# Altium project SL-A025-CTL-ESP07S_V1.0.PrjPcb
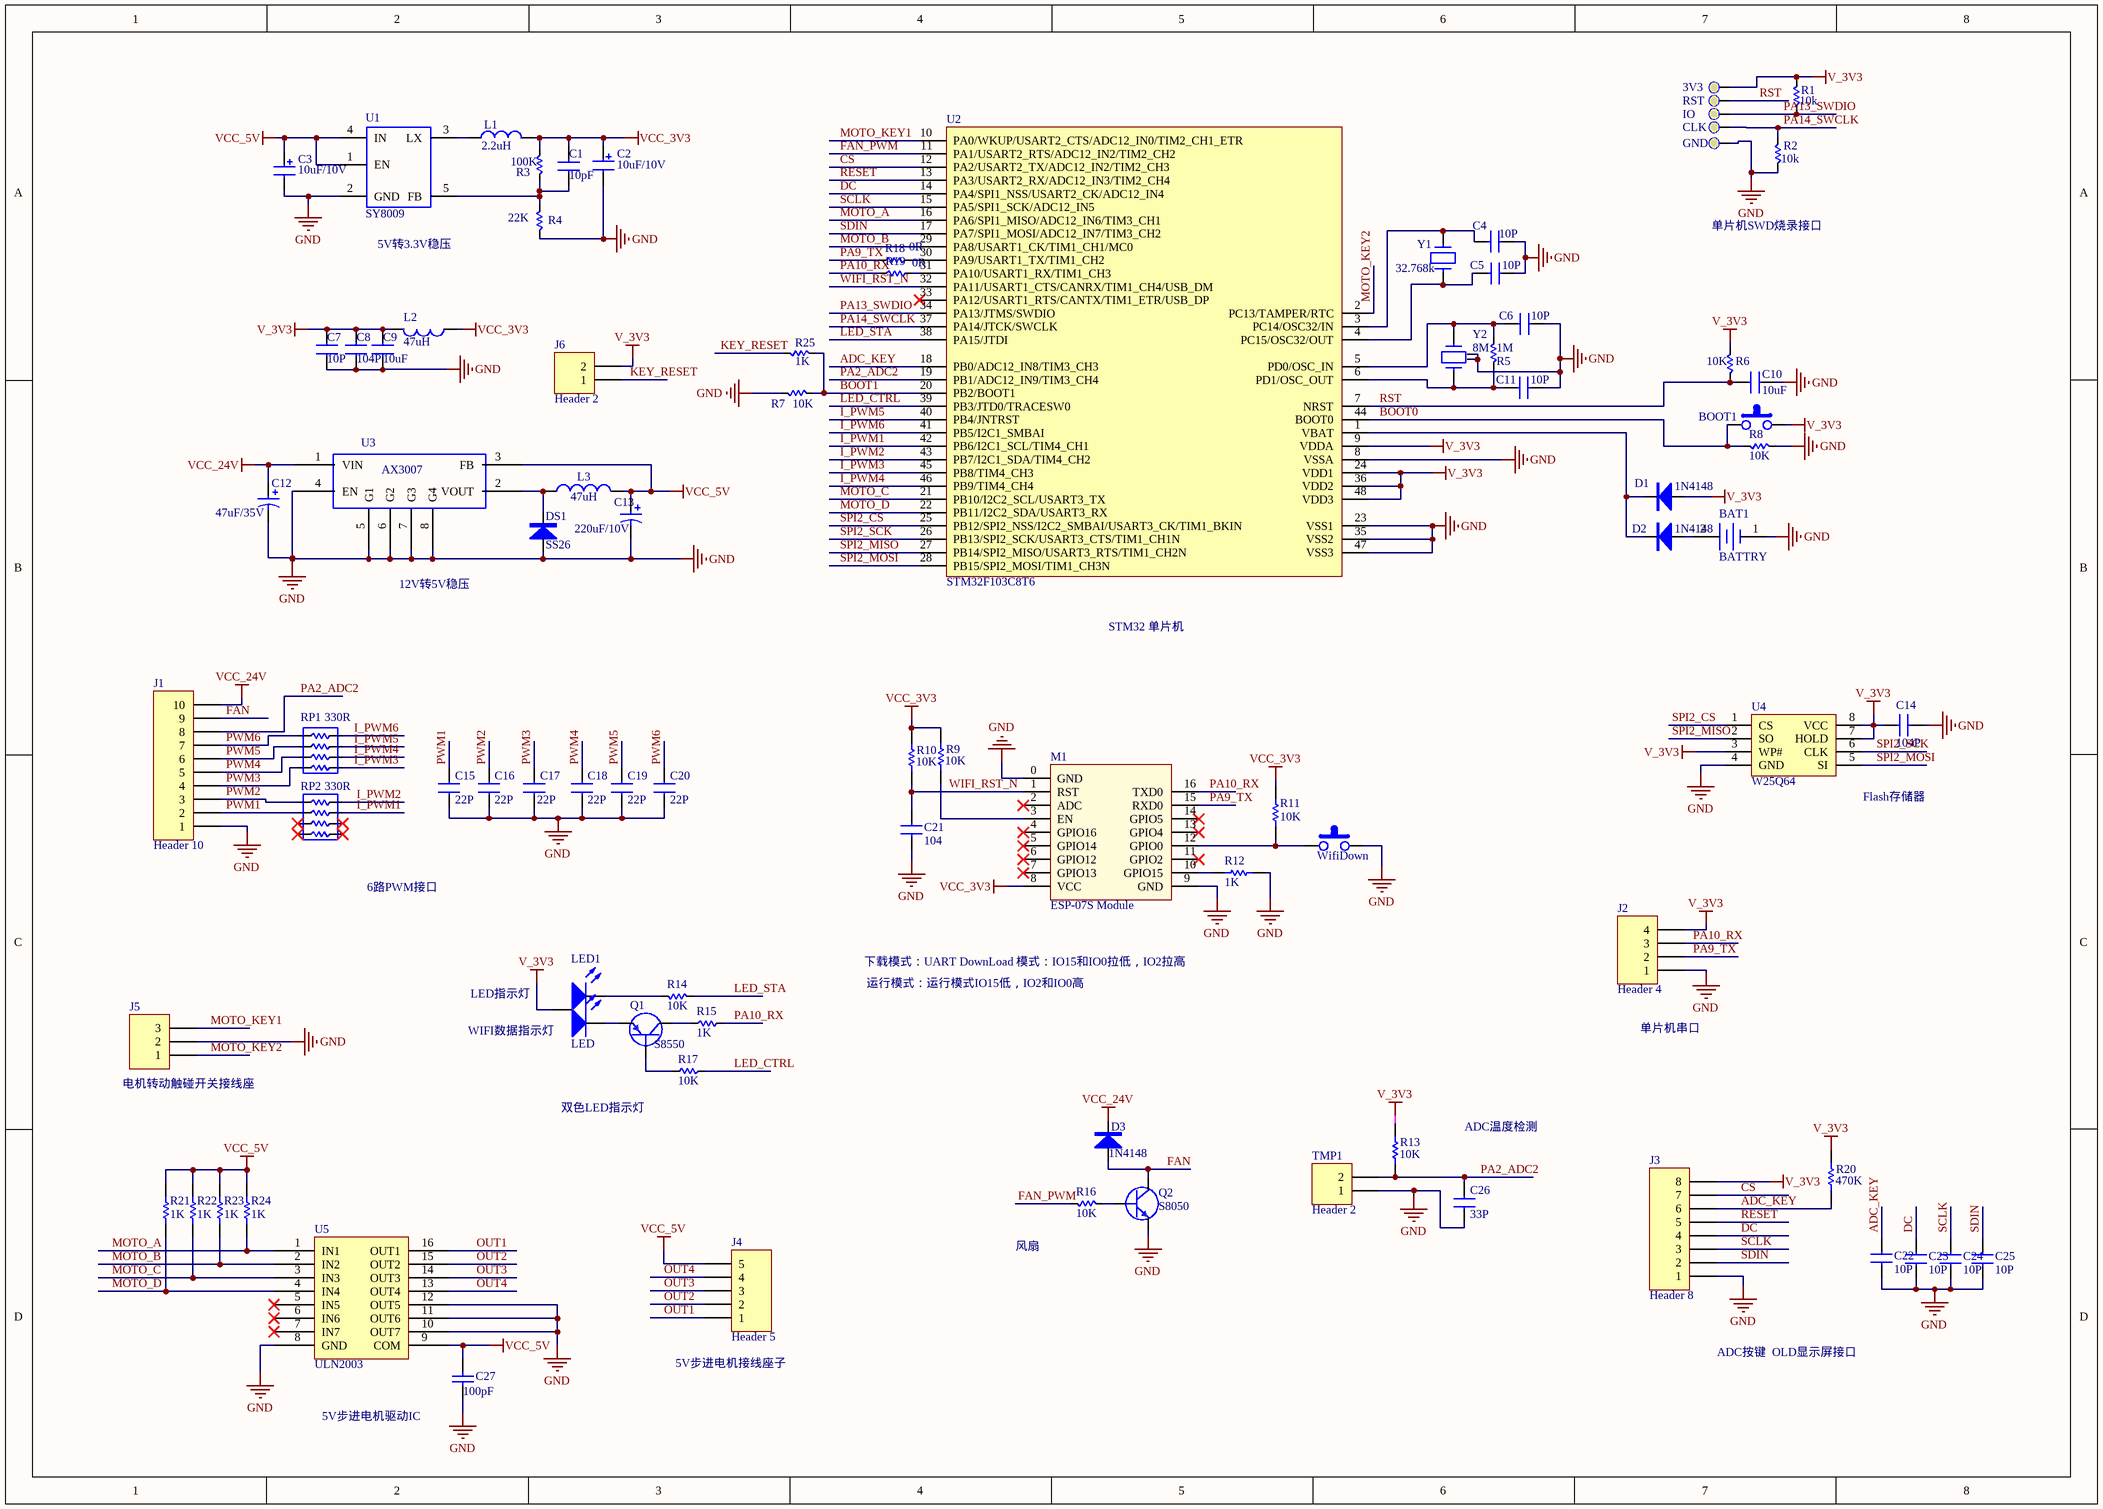
[diagram p0: SL-CA025-ESP07S_V1.0.SchDoc]
1 sheet, 87 parts. Net scope: global (net labels, ports and power ports of the same name join across sheets).
Board file: SL-CA025-ESP07S_V2.2.PcbDoc

## Sheet SL-CA025-ESP07S_V1.0.SchDoc
size A3; Organization: Altium Limited; Address1: L3, 12a Rodborough Rd; Address2: Frenchs Forest; Address3: NSW; Address4: Australia 2086

### Parts
3V3  TP  [TP1]  (value not drawn)
BAT1  BATTRY  [BAT_1220]
BOOT1  SW  [SW_3X6]  (value not drawn)
C1  10pF  [C0603]
C2  10uF/10V  [C0805]
C3  10uF/10V  [C0805]
C4  10P  [C0603]
C5  10P  [C0603]
C6  10P  [C0603]
C7  10P  [C0603]
C8  104P  [C0603]
C9  10uF  [C0805]
C10  10uF  [C0805]
C11  10P  [C0603]
C12  47uF/35V  [C_SMT63(5.9*6.6mm)]
C13  220uF/10V  [C_SMT63(5.9*6.6mm)]
C14  104P  [C0603]
C15  22P  [C0603]
C16  22P  [C0603]
C17  22P  [C0603]
C18  22P  [C0603]
C19  22P  [C0603]
C20  22P  [C0603]
C21  104  [C0603]
C22  10P  [C0603]
C23  10P  [C0603]
C24  10P  [C0603]
C25  10P  [C0603]
C26  33P  [C0603]
C27  value 100pF  [C0603]  (hidden comment: Cap)
CLK  TP  [TP1]  (value not drawn)
D1  1N4148  [D0805]
D2  1N4148  [D0805]
D3  1N4148  [D0805]
DS1  SS26  [SMA]
GND  TP  [TP1]  (value not drawn)
IO  TP  [TP1]  (value not drawn)
J1  Header 10  [CON10_1.5mm]
J2  Header 4  [SIP4A]
J3  Header 8  [con8_1.5mm]
J4  Header 5  [con5_1.5mm]
J5  Header 3  [CON3_1.5mm]  (value not drawn)
J6  Header 2  [CON2_1.5mm]
L1  2.2uH  [L2520]
L2  47uH  [L0805]
L3  47uH  [L_SMRH_7.3x7.3]
LED1  LED  [LED_2K]
M1  ESP-07S Module  [ESP-07S Module]
Q1  S8550  [SOT23-3]
Q2  S8050  [SOT23-3]
R1  10k  [R0603]
R2  10k  [R0603]
R3  100K  [R0603]
R4  22K  [R0603]
R5  1M  [R0603]
R6  10K  [R0603]
R7  10K  [R0603]
R8  10K  [R0603]
R9  10K  [R0603]
R10  10K  [R0603]
R11  10K  [R0603]
R12  1K  [R0603]
R13  10K  [R0603]
R14  10K  [R0603]
R15  1K  [R0603]
R16  10K  [R0603]
R17  10K  [R0603]
R18  0R  [R0603]
R19  0R  [R0603]
R20  470K  [R0603]
R21  value 1K  [R0603]  (hidden comment: Res1)
R22  value 1K  [R0603]  (hidden comment: Res1)
R23  value 1K  [R0603]  (hidden comment: Res1)
R24  value 1K  [R0603]  (hidden comment: Res1)
R25  1K  [R0603]
RP1  330R  [RP4_0603]
RP2  330R  [RP4_0603]
RST  TP  [TP1]  (value not drawn)
TMP1  Header 2  [CON2_1.5mm]
U1  SY8009  [SOT23-5]
U2  STM32F103C8T6  [LQFP48_9.2x9.2mm]
U3  AX3007  [SOP8_N]
U4  W25Q64  [SOIC8]
U5  ULN2003  [SOP16]
WifiDown  SW  [SW_3X6]  (value not drawn)
Y1  32.768k  [XALT_3215]
Y2  8M  [XALT_5032_4P]

### Nets
GND: BAT1.1 C2.2 C3.2 C4.2 C5.2 C6.2 C7.2 C8.2 C9.2 C10.2 C11.2 C12.2 C13.2 C14.2 C15.1 C16.1 C17.1 C18.1 C19.1 C20.1 C21.2 C22.1 C23.1 C24.1 C25.1 C26.1 C27.1 DS1.1(A) GND.1 J1.1 J2.1 J3.1 J5.2 M1.0(GND) M1.9(GND) Q2.2(E) R2.1 R4.1 R7.2 R8.2 R12.2 TMP1.1 U1.2(GND) U2.8(VSSA) U2.23(VSS1) U2.35(VSS2) U2.47(VSS3) U3.4(EN) U3.5(G1) U3.6(G2) U3.7(G3) U3.8(G4) U4.4(GND) U5.8(GND) U5.10(OUT7) U5.11(OUT6) U5.12(OUT5) WifiDown.2 Y2.2(GND) Y2.4(GND)
V_3V3: 3V3.1 BOOT1.2 C7.1 C8.1 C9.1 C14.1 D1.1 J2.4 J3.8 J6.2 L2.2 LED1.A R1.2 R6.2 R13.1 R20.1 U2.9(VDDA) U2.24(VDD1) U2.36(VDD2) U2.48(VDD3) U4.3(WP#) U4.7(HOLD) U4.8(VCC)
VCC_3V3: C1.1 C2.1 L1.2 L2.1 M1.8(VCC) R3.2 R9.1 R10.1 R11.2
VCC_5V: C3.1 C13.1 C27.2 J4.5 L3.2 R21.2 R22.2 R23.2 R24.2 U1.1(EN) U1.4(IN) U3.3(FB) U5.9(COM)
VCC_24V: C12.1 D3.2 J1.10 U3.1(VIN)
ADC_KEY: C22.2 J3.6 R20.2 U2.18(PB0/ADC12_IN8/TIM3_CH3)
BOOT0: BOOT1.1 R8.1 U2.44(BOOT0)
BOOT1: R7.1 R25.1 U2.20(PB2/BOOT1)
CS: J3.7 U2.12(PA2/USART2_TX/ADC12_IN2/TIM2_CH3)
DC: C23.2 J3.4 U2.14(PA4/SPI1_NSS/USART2_CK/ADC12_IN4)
FAN: D3.1 J1.9 Q2.3(E)
FAN_PWM: R16.1 U2.11(PA1/USART2_RTS/ADC12_IN2/TIM2_CH2)
I_PWM1: RP2.6 U2.42(PB6/I2C1_SCL/TIM4_CH1)
I_PWM2: RP2.5 U2.43(PB7/I2C1_SDA/TIM4_CH2)
I_PWM3: RP1.8 U2.45(PB8/TIM4_CH3)
I_PWM4: RP1.7 U2.46(PB9/TIM4_CH4)
I_PWM5: RP1.6 U2.40(PB4/JNTRST)
I_PWM6: RP1.5 U2.41(PB5/I2C1_SMBAI)
KEY_RESET: J6.1 R25.2
LED_CTRL: R17.2 U2.39(PB3/JTD0/TRACESW0)
LED_STA: R14.1 U2.38(PA15/JTDI)
MOTO_A: R24.1 U2.16(PA6/SPI1_MISO/ADC12_IN6/TIM3_CH1) U5.1(IN1)
MOTO_B: R23.1 U2.29(PA8/USART1_CK/TIM1_CH1/MC0) U5.2(IN2)
MOTO_C: R22.1 U2.21(PB10/I2C2_SCL/USART3_TX) U5.3(IN3)
MOTO_D: R21.1 U2.22(PB11/I2C2_SDA/USART3_RX) U5.4(IN4)
MOTO_KEY1: J5.3 U2.10(PA0/WKUP/USART2_CTS/ADC12_IN0/TIM2_CH1_ETR)
MOTO_KEY2: J5.1 U2.2(PC13/TAMPER/RTC)
OUT1: J4.1 U5.16(OUT1)
OUT2: J4.2 U5.15(OUT2)
OUT3: J4.3 U5.14(OUT3)
OUT4: J4.4 U5.13(OUT4)
PA2_ADC2: C26.2 J1.8 R13.2 TMP1.2 U2.19(PB1/ADC12_IN9/TIM3_CH4)
PA9_TX: J2.2 M1.15(RXD0) R18.1
PA10_RX: J2.3 M1.16(TXD0) R15.1 R19.1
PA13_SWDIO: IO.1 R1.1 U2.34(PA13/JTMS/SWDIO)
PA14_SWCLK: CLK.1 R2.2 U2.37(PA14/JTCK/SWCLK)
PWM1: C15.2 J1.2 RP2.3
PWM2: C16.2 J1.3 RP2.4
PWM3: C17.2 J1.4 RP1.1
PWM4: C18.2 J1.5 RP1.2
PWM5: C19.2 J1.6 RP1.3
PWM6: C20.2 J1.7 RP1.4
RESET: J3.5 U2.13(PA3/USART2_RX/ADC12_IN3/TIM2_CH4)
RST: C10.1 R6.1 RST.1 U2.7(NRST)
SCLK: C24.2 J3.3 U2.15(PA5/SPI1_SCK/ADC12_IN5)
SDIN: C25.2 J3.2 U2.17(PA7/SPI1_MOSI/ADC12_IN7/TIM3_CH2)
SPI2_CS: U2.25(PB12/SPI2_NSS/I2C2_SMBAI/USART3_CK/TIM1_BKIN) U4.1(CS)
SPI2_MISO: U2.27(PB14/SPI2_MISO/USART3_RTS/TIM1_CH2N) U4.2(SO)
SPI2_MOSI: U2.28(PB15/SPI2_MOSI/TIM1_CH3N) U4.5(SI)
SPI2_SCK: U2.26(PB13/SPI2_SCK/USART3_CTS/TIM1_CH1N) U4.6(CLK)
WIFI_RST_N: C21.1 M1.1(RST) R10.2 U2.32(PA11/USART1_CTS/CANRX/TIM1_CH4/USB_DM)
NetBAT1_2: BAT1.2 D2.1(A)
NetC1_2: C1.2 R3.1 R4.2 U1.5(FB)
NetC4_1: C4.1 U2.3(PC14/OSC32/IN) Y1.2
NetC5_1: C5.1 U2.4(PC15/OSC32/OUT) Y1.1
NetC6_1: C6.1 R5.2 U2.5(PD0/OSC_IN) Y2.3
NetC11_1: C11.1 R5.1 U2.6(PD1/OSC_OUT) Y2.1
NetD1_2: D1.2 D2.2(K) U2.1(VBAT)
NetDS1_2: DS1.2(K) L3.1 U3.2(VOUT)
NetL1_1: L1.1 U1.3(LX)
NetLED1_K1: LED1.K1 R14.2
NetLED1_K2: LED1.K2 Q1.2(E)
NetM1_3: M1.3(EN) R9.2
NetM1_10: M1.10(GPIO15) R12.1
NetM1_12: M1.12(GPIO0) R11.1 WifiDown.1
NetQ1_1: Q1.1(B) R17.1
NetQ1_3: Q1.3(C) R15.2
NetQ2_1: Q2.1(B) R16.2
NetR18_2: R18.2 U2.30(PA9/USART1_TX/TIM1_CH2)
NetR19_2: R19.2 U2.31(PA10/USART1_RX/TIM1_CH3)

Not connected (* = marked no-connect by the designer): M1 2(ADC)* 4(GPIO16)* 5(GPIO14)* 6(GPIO12)* 7(GPIO13)* 11(GPIO2)* 13(GPIO4)* 14(GPIO5)*; RP2 1* 2* 7* 8*; U2 33(PA12/USART1_RTS/CANTX/TIM1_ETR/USB_DP)*; U5 5(IN5)* 6(IN6)* 7(IN7)*

### Notes on the sheet
- (near U1) 5V转3.3V稳压
- 单片机SWD烧录接口
- 12V转5V稳压
- STM32 单片机
- (near U4) Flash存储器
- 6路PWM接口
- 下载模式：UART DownLoad 模式：IO15和IO0拉低，IO2拉高
- 运行模式：运行模式IO15低，IO2和IO0高
- (near LED1) WIFI数据指示灯
- LED指示灯
- (near J2) 单片机串口
- (near J5) 电机转动触碰开关接线座
- 双色LED指示灯
- ADC温度检测
- 风扇
- (near J4) 5V步进电机接线座子
- ADC按键  OLD显示屏接口
- 5V步进电机驱动IC

### Library data of the parts
3V3 CLK GND IO RST = TP1
BAT1 = BA
BOOT1 WifiDown = But
C1 C4-C11 C14-C26 = CAP: Capacitor; IC: *
C2 C3 = CAP+
C12 C13 = C: Bi-Polar Capacitor
C27 = Cap: Capacitor; Published: 8-Jun-2000; LatestRevisionDate: 17-Jul-2002; LatestRevisionNote: Re-released for DXP Platform.; PackageReference: RAD-0.3; Publisher: Altium Limited; PackageDescription: Radial Cap, Thru-Hole; 2 Leads; 0.3 in Pin Spacing
D1-D3 DS1 = DIODE
J1 = Header 10H: Header, 10-Pin, Right Angle; LatestRevisionDate: 17-Jul-2002; LatestRevisionNote: Re-released for DXP Platform.; Publisher: Altium Limited
J2 = Header 4: Header, 4-Pin; LatestRevisionDate: 17-Jul-2002; LatestRevisionNote: Re-released for DXP Platform.; Publisher: Altium Limited
J3 = Header 8: Header, 8-Pin; LatestRevisionDate: 17-Jul-2002; LatestRevisionNote: Re-released for DXP Platform.; Publisher: Altium Limited
J4 = Header 5: Header, 5-Pin; LatestRevisionDate: 17-Jul-2002; LatestRevisionNote: Re-released for DXP Platform.; Publisher: Altium Limited
J5 = Header 3: Header, 3-Pin; LatestRevisionDate: 17-Jul-2002; LatestRevisionNote: Re-released for DXP Platform.; Publisher: Altium Limited
J6 TMP1 = Header 2: Header, 2-Pin; LatestRevisionDate: 17-Jul-2002; LatestRevisionNote: Re-released for DXP Platform.; Publisher: Altium Limited
L1 L2 = L
L3 = INDUCTOR
LED1 = LED_2K: 共阳极双色LED
Q1 = PNP
Q2 = PNP2
R1-R8 R14-R19 R25 = RES
R9-R13 R20 = Res1: Resistor; Value: 330R; Published: 8-Jun-2000; LatestRevisionDate: 17-Jul-2002; LatestRevisionNote: Re-released for DXP Platform.; PackageReference: AXIAL-0.3; Publisher: Altium Limited; PackageDescription: Axial Device, Thru-Hole; 2 Leads; 0.3 in Pin Spacing
R21-R24 = Res1: Resistor; Published: 8-Jun-2000; LatestRevisionDate: 17-Jul-2002; LatestRevisionNote: Re-released for DXP Platform.; PackageReference: AXIAL-0.3; Publisher: Altium Limited; PackageDescription: Axial Device, Thru-Hole; 2 Leads; 0.3 in Pin Spacing
RP1 RP2 = RES_PACK4
U1 = SY
U2 = S
U3 = AX
U4 = W2
U5 = ULN2003: 电机驱动IC
Y1 = CRY
Y2 = Crystal_4p